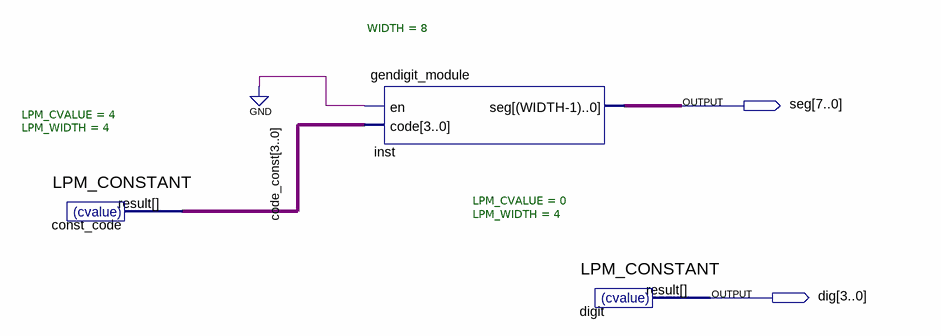
[diagram p0: schematic sheet]
// Quartus schematic gendigit.bdf as structural Verilog: 3 symbols, 2 pins
module gendigit (
  output [7:0] seg,
  output [3:0] dig
);

  wire [3:0] code_const;

  LPM_CONSTANT #(.LPM_CVALUE(4), .LPM_WIDTH(4)) const_code (.result(code_const));
  gendigit_module #(.WIDTH(8)) inst (.en(1'b0), .code(code_const), .seg(seg));
  LPM_CONSTANT #(.LPM_CVALUE(0), .LPM_WIDTH(4)) digit (.result(dig));
endmodule
